# EAGLE design ftdifriend-usb (EAGLE 7.2.0)
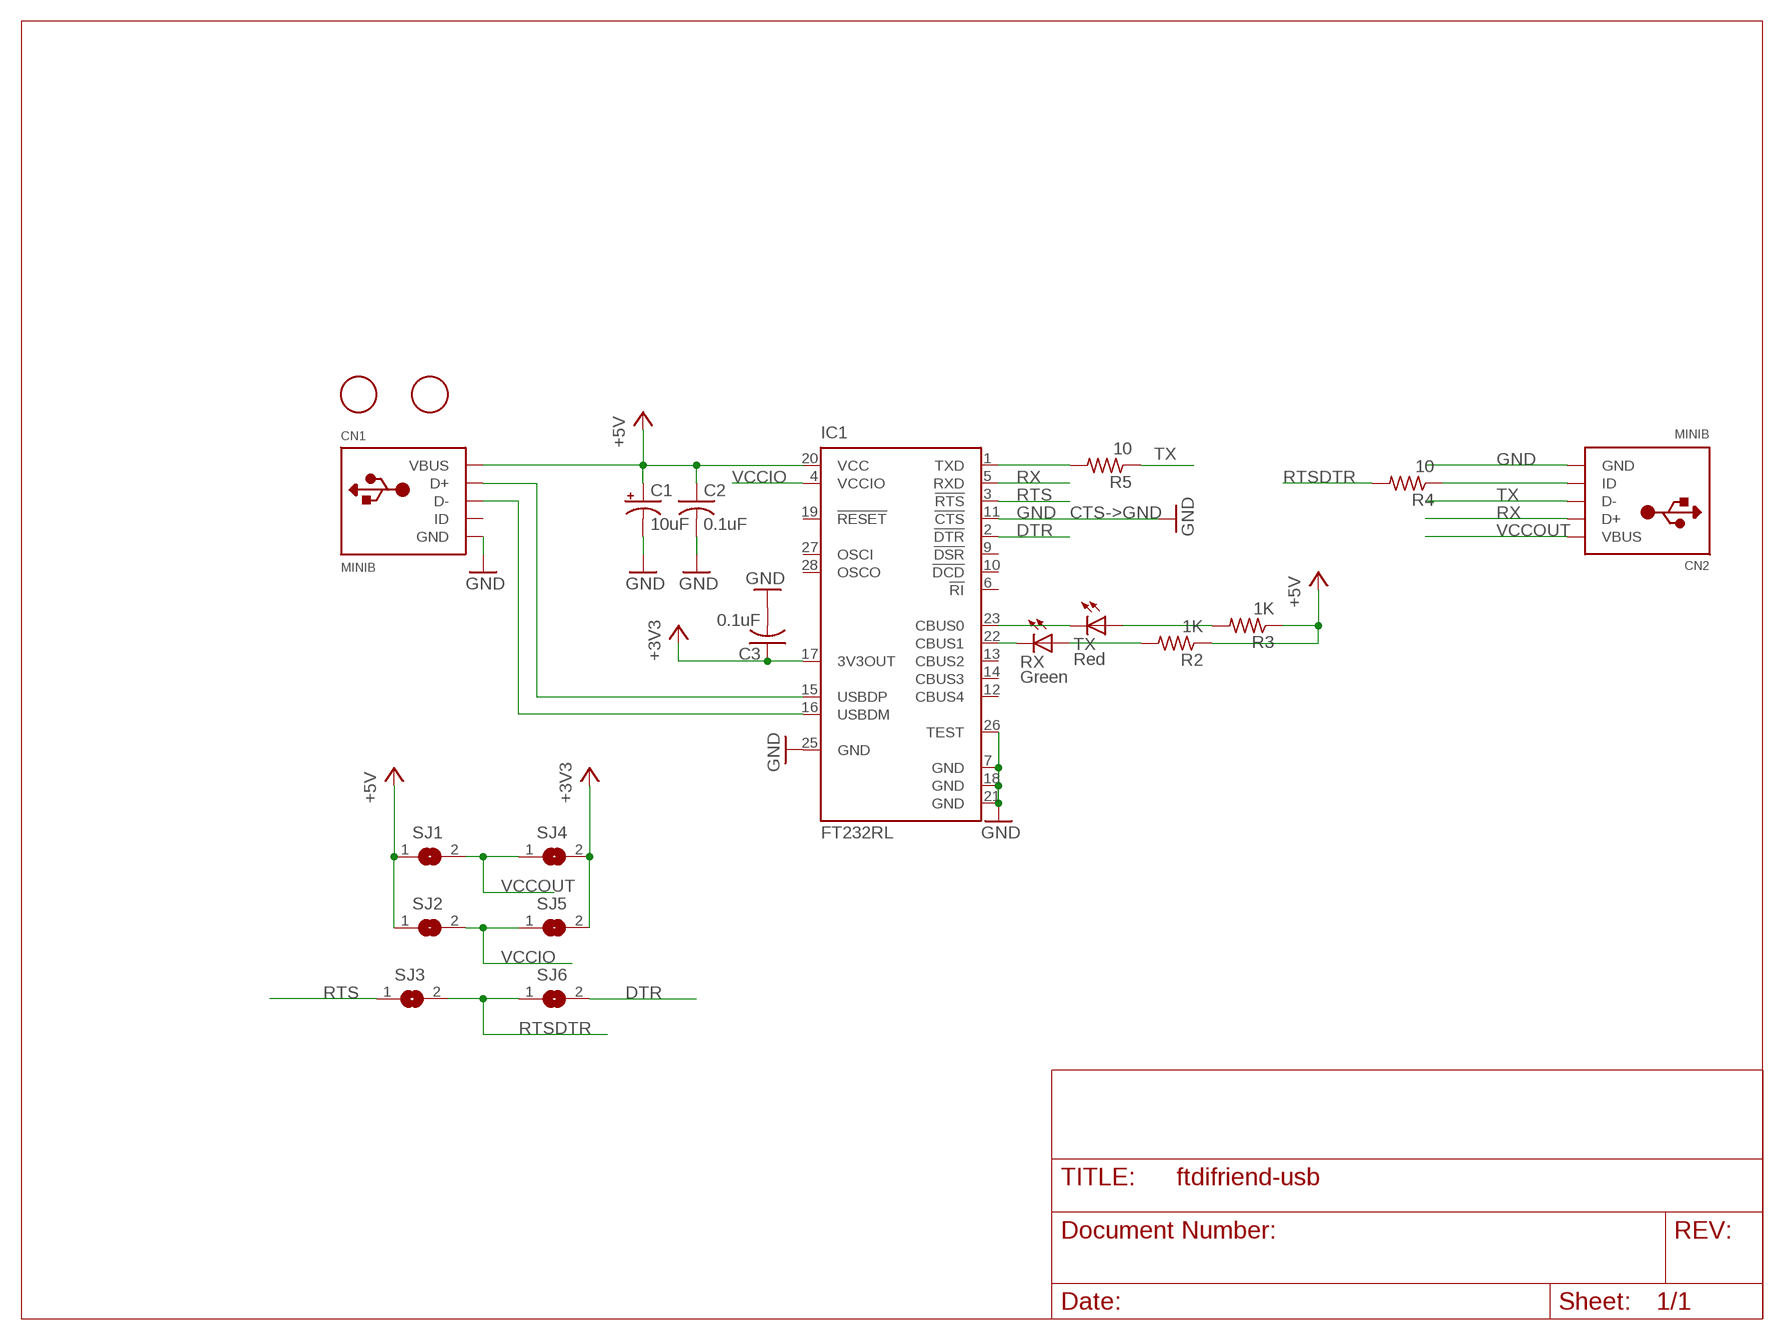
[diagram p0: schematic, sheet 1]

## Parts
C1  10uF  CPOL-USA/3216-18R  [A/3216-18R]
C2  0.1uF  C-USC0805K  [C0805K]
C3  0.1uF  C-USC0805K  [C0805K]
CN1  MINIB  USBMINIB  [USB-MINIB]
CN2  MINIB  USBMINIB  [USB-MINIB]
IC1  FT232RL  [SSOP28]
R2  1K  R-US_R0805  [R0805]
R3  1K  R-US_R0805  [R0805]
R4  10  R-US_R0805  [R0805]
R5  10  R-US_R0805  [R0805]
RX  Green  LEDCHIP-LED0805  [CHIP-LED0805]
SJ1  SJ  [SJ]
SJ2  SJ  [SJ]
SJ3  SJ  [SJ]
SJ4  SJ  [SJ]
SJ5  SJ  [SJ]
SJ6  SJ  [SJ]
TX  Red  LEDCHIP-LED0805  [CHIP-LED0805]
U$1  FIDUCIAL  [FIDUCIAL_1MM]
U$2  FIDUCIAL  [FIDUCIAL_1MM]

## Nets
1: CN2.ID R4.1
+3V3: C3.1 IC1.17(3V3OUT) SJ4.2 SJ5.2
+5V: C1.+ C2.1 CN1.VBUS IC1.20(VCC) R2.1 R3.1 SJ1.1 SJ2.1
DTR: IC1.2(!DTR) SJ6.2
GND: C1.- C2.2 C3.2 CN1.GND CN2.GND IC1.7(GND) IC1.11(!CTS) IC1.18(GND) IC1.21(GND) IC1.25(GND) IC1.26(TEST)
N$3: CN1.D+ IC1.15(USBDP)
N$4: CN1.D- IC1.16(USBDM)
N$5: IC1.1(TXD) R5.2
N$6: IC1.23(CBUS0) TX.C
N$7: IC1.22(CBUS1) RX.C
N$8: R2.2 RX.A
N$9: R3.2 TX.A
RTS: IC1.3(!RTS) SJ3.1
RTSDTR: R4.2 SJ3.2 SJ6.1
RX: CN2.D+ IC1.5(RXD)
TX: CN2.D- R5.1
VCCIO: IC1.4(VCCIO) SJ2.2 SJ5.1
VCCOUT: CN2.VBUS SJ1.2 SJ4.1
Unconnected: CN1.ID IC1.6(!RI) IC1.9(!DSR) IC1.10(!DCD) IC1.12(CBUS4) IC1.13(CBUS2) IC1.14(CBUS3) IC1.19(!RESET) IC1.27(OSCI) IC1.28(OSCO)

## Notes on the sheet
- CTS->GND

## Library data of the parts
C1 = adafruit:CPOL-US: POLARIZED CAPACITOR, American symbol
C2 C3 = adafruit:C-US: CAPACITOR, American symbol
CN1 CN2 = adafruit:USB: USB Connectors USBMINIB - Surface Mount Female Mini-B USB Connector 4UConnector: 06564 By microbuilder.eu Thru-hole RA Female Mini-B USB Connector 4UConnector: 18732 By ladyada.net
IC1 = ftdichip:FT232R: Source: http://www.ftdichip.com/Documents/DataSheets/DS_FT232R_v104.pdf
R2-R5 = adafruit:R-US_: RESISTOR, American symbol
RX TX = adafruit:LED: LED OSRAM: - CHIPLED LG R971, LG N971, LY N971, LG Q971, LY Q971, LO R971, LY R971 LH N974, LH R974 LS Q976, LO Q976, LY Q976 LO Q996 - Hyper CHIPLED LW Q18S LB Q993, LB Q99A, LB R99A - SideLED LS A670, LO A670, LY A670, LG A670, LP A670 LB A673, LV A673, LT A673, LW A673 LH A674 LY A675 LS A676, LA A676, LO A676, LY A676, LW A676 LS A679, LY A679, LG A679 - Hyper Micro SIDELED® LS Y876, LA Y876, LO Y876, LY Y876 LT Y87S - SmartLED LW L88C, LW L88S LB L89C, LB L89S, LG L890 LS L89K, LO L89K, LY L89K LS L896, LA L896, LO L896, LY L896 - TOPLED LS T670, LO T670, LY T670, LG T670, LP T670 LSG T670, LSP T670, LSY T670, LOP T670, LYG T670 LG T671, LOG T671, LSG T671 LB T673, LV T673, LT T673, LW T673 LH T674 LS T676, LA T676, LO T676, LY T676, LB T676, LH T676, LSB T676, LW T676 LB T67C, LV T67C, LT T67C, LS T67K, LO T67K, LY T67K, LW E67C LS E67B, LA E67B, LO E67B, LY E67B, LB E67C, LV E67C, LT E67C LW T67C LS T679, LY T679, LG T679 LS T770, LO T770, LY T770, LG T770, LP T770 LB T773, LV T773, LT T773, LW T773 LH T774 LS E675, LA E675, LY E675, LS T675 LS T776, LA T776, LO T776, LY T776, LB T776 LHGB T686 LT T68C, LB T68C - Hyper Mini TOPLED® LB M676 - Mini TOPLED Santana® LG M470 LS M47K, LO M47K, LY M47K Source: http://www.osram.convergy.de/
SJ1-SJ6 = jumper:SJ: SMD solder JUMPER
U$1 U$2 = adafruit:FIDUCIAL: For use by pick and place machines to calibrate the vision/machine, 1mm By microbuilder.eu

## Board
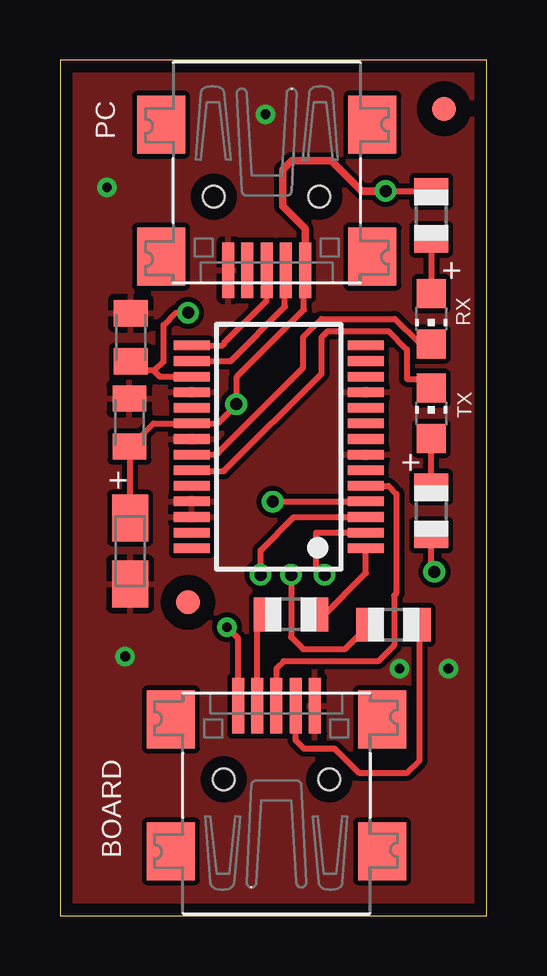
[diagram p1: board, top side]
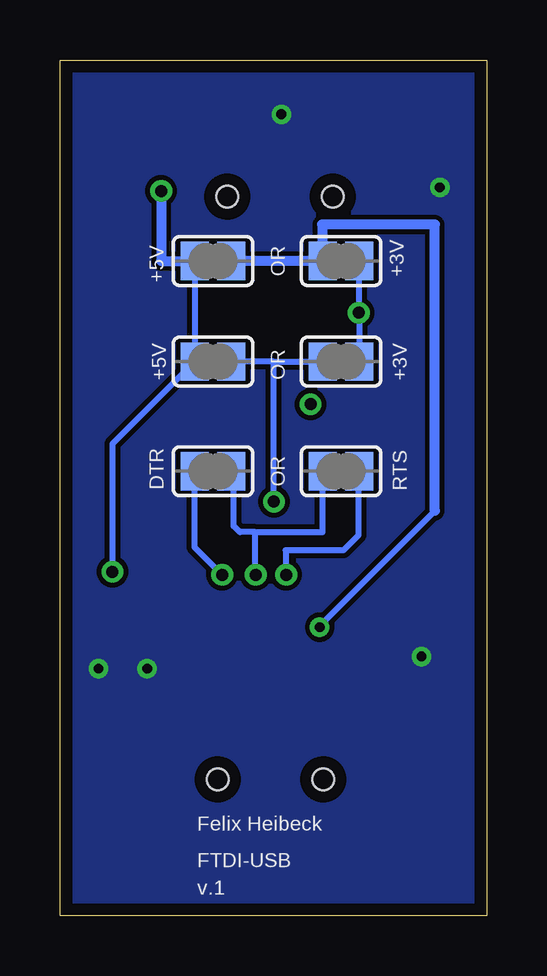
[diagram p2: board, bottom side, seen from below]

Size 17.78 x 35.69 mm. Coordinates in mm from the lower left corner, seen from the top.
Outline: 0,35.69 0,0 17.78,0 17.78,35.69 0,35.69
Copper layers (1*16): Top 0.035mm / dielectric 1.5mm / Bottom 0.035mm
Design rules "default *": minimum track width 10mil, minimum drill 19mil, track to track 8mil, track to pad 8mil, pad to pad 8mil, via to via 8mil, smd to smd 8mil, copper to edge 20mil, drill to drill 8mil, minimum pad ring 10mil, minimum via ring 8mil, stop-mask expansion 4mil, vias tented up to drill 20mil, thermal gap 10mil

### Footprints (pad centres in the part's own frame; a part is rotated, then mirrored left to right if it is on the bottom)
A/3216-18R = smd 1.95 x 1.5: + 1.375,0; - -1.375,0
C0805K = smd 1.1 x 1.4: 1 -1,0; 2 1,0
USB-MINIB = smd 0.5 x 2.308: D+ 0,4.064; D- -0.8,4.064; GND 1.6,4.064; ID 0.8,4.064; VBUS -1.6,4.064 | smd 2 x 2.4: GND1 -4.4,-2; GND2 -4.4,3.5; GND3 4.4,3.5; GND4 4.4,-2 | hole 0.9: -2.2,1; 2.2,1
SSOP28 = smd 0.4 x 1.5: 1 -4.225,-3.625; 2 -3.575,-3.625; 3 -2.925,-3.625; 4 -2.275,-3.625; 5 -1.625,-3.625; 6 -0.975,-3.625; 7 -0.325,-3.625; 8 0.325,-3.625; 9 0.975,-3.625; 10 1.625,-3.625; 11 2.275,-3.625; 12 2.925,-3.625; 13 3.575,-3.625; 14 4.225,-3.625; 15 4.225,3.625; 16 3.575,3.625; 17 2.925,3.625; 18 2.275,3.625; 19 1.625,3.625; 20 0.975,3.625; 21 0.325,3.625; 22 -0.325,3.625; 23 -0.975,3.625; 24 -1.625,3.625; 25 -2.275,3.625; 26 -2.925,3.625; 27 -3.575,3.625; 28 -4.225,3.625
R0805 = smd 1.1 x 1.4: 1 -1,0; 2 1,0
CHIP-LED0805 = smd 1.2 x 1.2: A 0,-1.05; C 0,1.05
SJ = smd 1.168 x 1.6: 1 -0.762,0; 2 0.762,0
FIDUCIAL_1MM = smd 1 x 1: 1 0,0

### Placement (x,y rotation side)
C1  2.92,15.21 90 top
C2  2.9,20.57 90 top
C3  2.95,24.13 90 top
CN1  8.61,30.99 180 top
CN2  9.02,4.7 0 top
IC1  9.12,19.56 90 top
R2  15.47,29.21 270 top
R3  15.47,16.89 90 top
R4  13.89,12.14 180 top
R5  9.63,12.57 0 top
RX  15.47,24.89 180 top
SJ1  11.4,27.3 0 bottom
SJ2  11.4,23.11 0 bottom
SJ3  6.07,18.54 180 bottom
SJ4  6.07,27.3 0 bottom
SJ5  6.07,23.11 0 bottom
SJ6  11.4,18.54 180 bottom
TX  15.47,20.95 0 top
U$1  16,33.66 270 top
U$2  5.33,13.08 270 top

### Tracks (layer width: path | path; a pad name or v marks a point on that pad's centre or on a via)
1
  Top 0.254: CN2.ID 9.8,8.75 9.8,7.34 10.16,6.98 11.43,6.98 12.45,5.97 14.48,5.97 14.99,6.48 14.99,12.05 R4.1
+3V3  (via drill 0.5)
  Top 0.254: IC1.17 4.16,22.48 3.91,22.73 | 3.17,22.99 3.19,23 | 3.91,22.73 3.43,22.73 3.17,22.99 | 2.95,23.22 2.92,23.24 | 2.95,23.22 C3.1 | 3.17,22.99 2.95,23.22 | v5.33,25.15 4.83,25.15 4.32,24.64 4.32,23.11 3.94,22.73 3.91,22.73
  Bottom 0.254: 5.31,25.12 SJ4.2 | 5.31,25.12 SJ5.2 | v5.33,25.15 5.31,25.12
+5V  (via drill 0.5)
  Top 0.254: CN1.VBUS 10.16,26.87 10.16,25.27 7.37,22.48 7.37,21.34 v7.34,21.34 7.34,21.31 6.56,20.53 IC1.20 3.9,20.53 2.94,19.57 C2.1 2.9,19.66 2.92,19.68 C1.+ | v13.56,30.23 13.59,30.23 13.61,30.21 R2.1 | v15.6,14.35 15.62,14.35 15.47,14.5 R3.1
  Top 0.305: CN1.VBUS 10.21,28.65 9.27,29.59 9.27,31.12 9.65,31.5 11.3,31.5 12.57,30.23 13.46,30.23 13.56,30.12 | 13.56,30.12 13.59,30.1 | 13.56,30.12 v13.56,30.23
  Bottom 0.254: v15.6,14.35 15.6,19.68 SJ2.1 12.17,27.28 12.19,27.3 SJ1.1 | 7.34,21.59 v7.34,21.34 7.34,21.21 7.37,21.21
  Bottom 0.406: v13.56,30.23 13.56,27.3 12.19,27.3
DTR  (via drill 0.5)
  Top 0.254: IC1.2 10.67,15.98 10.67,14.61 11.05,14.22 v11.02,14.22
  Bottom 0.254: v11.02,14.22 12.17,15.37 SJ6.2
GND  (via drill 0.41)
  other vias: 14.15,10.31 16.18,10.31 2.72,10.82 1.96,30.38 8.56,33.43
  pour Top: 18.26,35.81 -0.28,35.81 -0.28,0 18.26,0.13
  pour Bottom: -1.78,36.7 19.05,36.7 19.05,-0.63 -1.78,-0.63
N$1
  Bottom 0.254: 6.6,18.54 5.46,18.54
N$3
  Top 0.254: CN1.D+ 8.61,25.65 6.83,23.88 6.86,23.88 6.76,23.78 IC1.15
N$4
  Top 0.254: IC1.16 7.11,23.13 9.37,25.4 9.37,26.42 9.41,26.45 CN1.D-
N$5
  Top 0.254: IC1.1 12.74,14.29 10.88,12.43 10.68,12.43 10.54,12.57 R5.2
N$6
  Top 0.254: IC1.23 5.01,18.58 5.05,18.54 6.83,18.54 10.9,22.61 10.9,24.13 11.15,24.38 13.69,24.38 14.45,23.62 14.45,22.39 15.08,22.39 15.62,21.84 | 15.62,21.84 15.62,21.78 | 15.62,21.84 15.62,21.98 | 15.62,21.84 TX.C
N$7
  Top 0.254: IC1.22 6.53,19.23 6.6,19.3 6.58,19.3 10.13,22.86 10.13,24.13 10.9,24.89 13.95,24.89 14.96,23.88 15.49,23.88 15.49,23.87 RX.C
N$8
  Top 0.254: RX.A 15.49,25.97 15.49,28.19 15.47,28.22 | 15.47,28.22 15.37,28.32 | 15.47,28.22 R2.2
N$9
  Top 0.254: R3.2 TX.A
N$12
  Bottom 0.254: 6.73,23.11 5.21,23.11
N$13
  Bottom 0.254: 12.06,27.3 10.54,27.3 10.41,27.56
RTS  (via drill 0.5)
  Top 0.254: IC1.3 9.75,16.63 8.36,15.24 v8.36,14.22
  Bottom 0.254: 5.56,18.8 SJ3.1 5.33,18.54 | v8.36,14.22 8.38,14.22 8.38,15.24 5.97,15.24 5.33,15.88 5.33,18.54 | 5.59,18.41 5.46,18.41 5.33,18.54
RTSDTR  (via drill 0.5)
  Top 0.254: v9.63,14.22 9.63,11.63 10.13,11.12 11.88,11.12 R4.2
  Bottom 0.254: 10.54,18.64 10.54,18.67 | 10.54,18.64 SJ6.1 | v9.63,14.22 9.65,14.25 9.65,16 | 9.65,16 10.29,16 10.54,16.26 10.54,18.64 | SJ3.2 6.83,16 9.65,16
RX
  Top 0.254: IC1.5 13.69,17.93 14.02,17.6 14.02,13.46 13.92,13.36 13.92,11.28 13.26,10.62 9.32,10.62 9.02,10.31 CN2.D+
TX
  Top 0.254: CN2.D- 8.22,12.16 R5.1
VCCIO  (via drill 0.5)
  Top 0.254: IC1.4 8.88,17.28 v8.87,17.27
  Bottom 0.254: 8.87,23.11 SJ5.1 | 8.87,23.11 SJ2.2 | v8.87,17.27 8.87,23.11
VCCOUT  (via drill 0.41)
  Top 0.254: CN2.VBUS 7.42,11.58 v6.96,12.04
  Bottom 0.254: 7.34,27.3 7.09,27.56 SJ4.1 6.83,27.18 6.86,27.18 | v6.96,12.04 6.96,12.09 2.16,16.89
  Bottom 0.406: 7.34,27.3 SJ1.2 | 2.16,16.89 2.16,28.83 6.86,28.83 6.86,27.18

### Text on the board
tPlace: PC | BOARD
bPlace: +3V | OR | +5V | +3V | +5V | OR | RTS | OR | DTR | Felix Heibeck | FTDI-USB | v.1